# EasyEDA schematic PCB Schematic V1.json
TITLE: Sheet_1; REV: 1.0; Date: 2026-10-07; Sheet: 1/1; Drawn By: campbelljacobs21; Company: Your Company
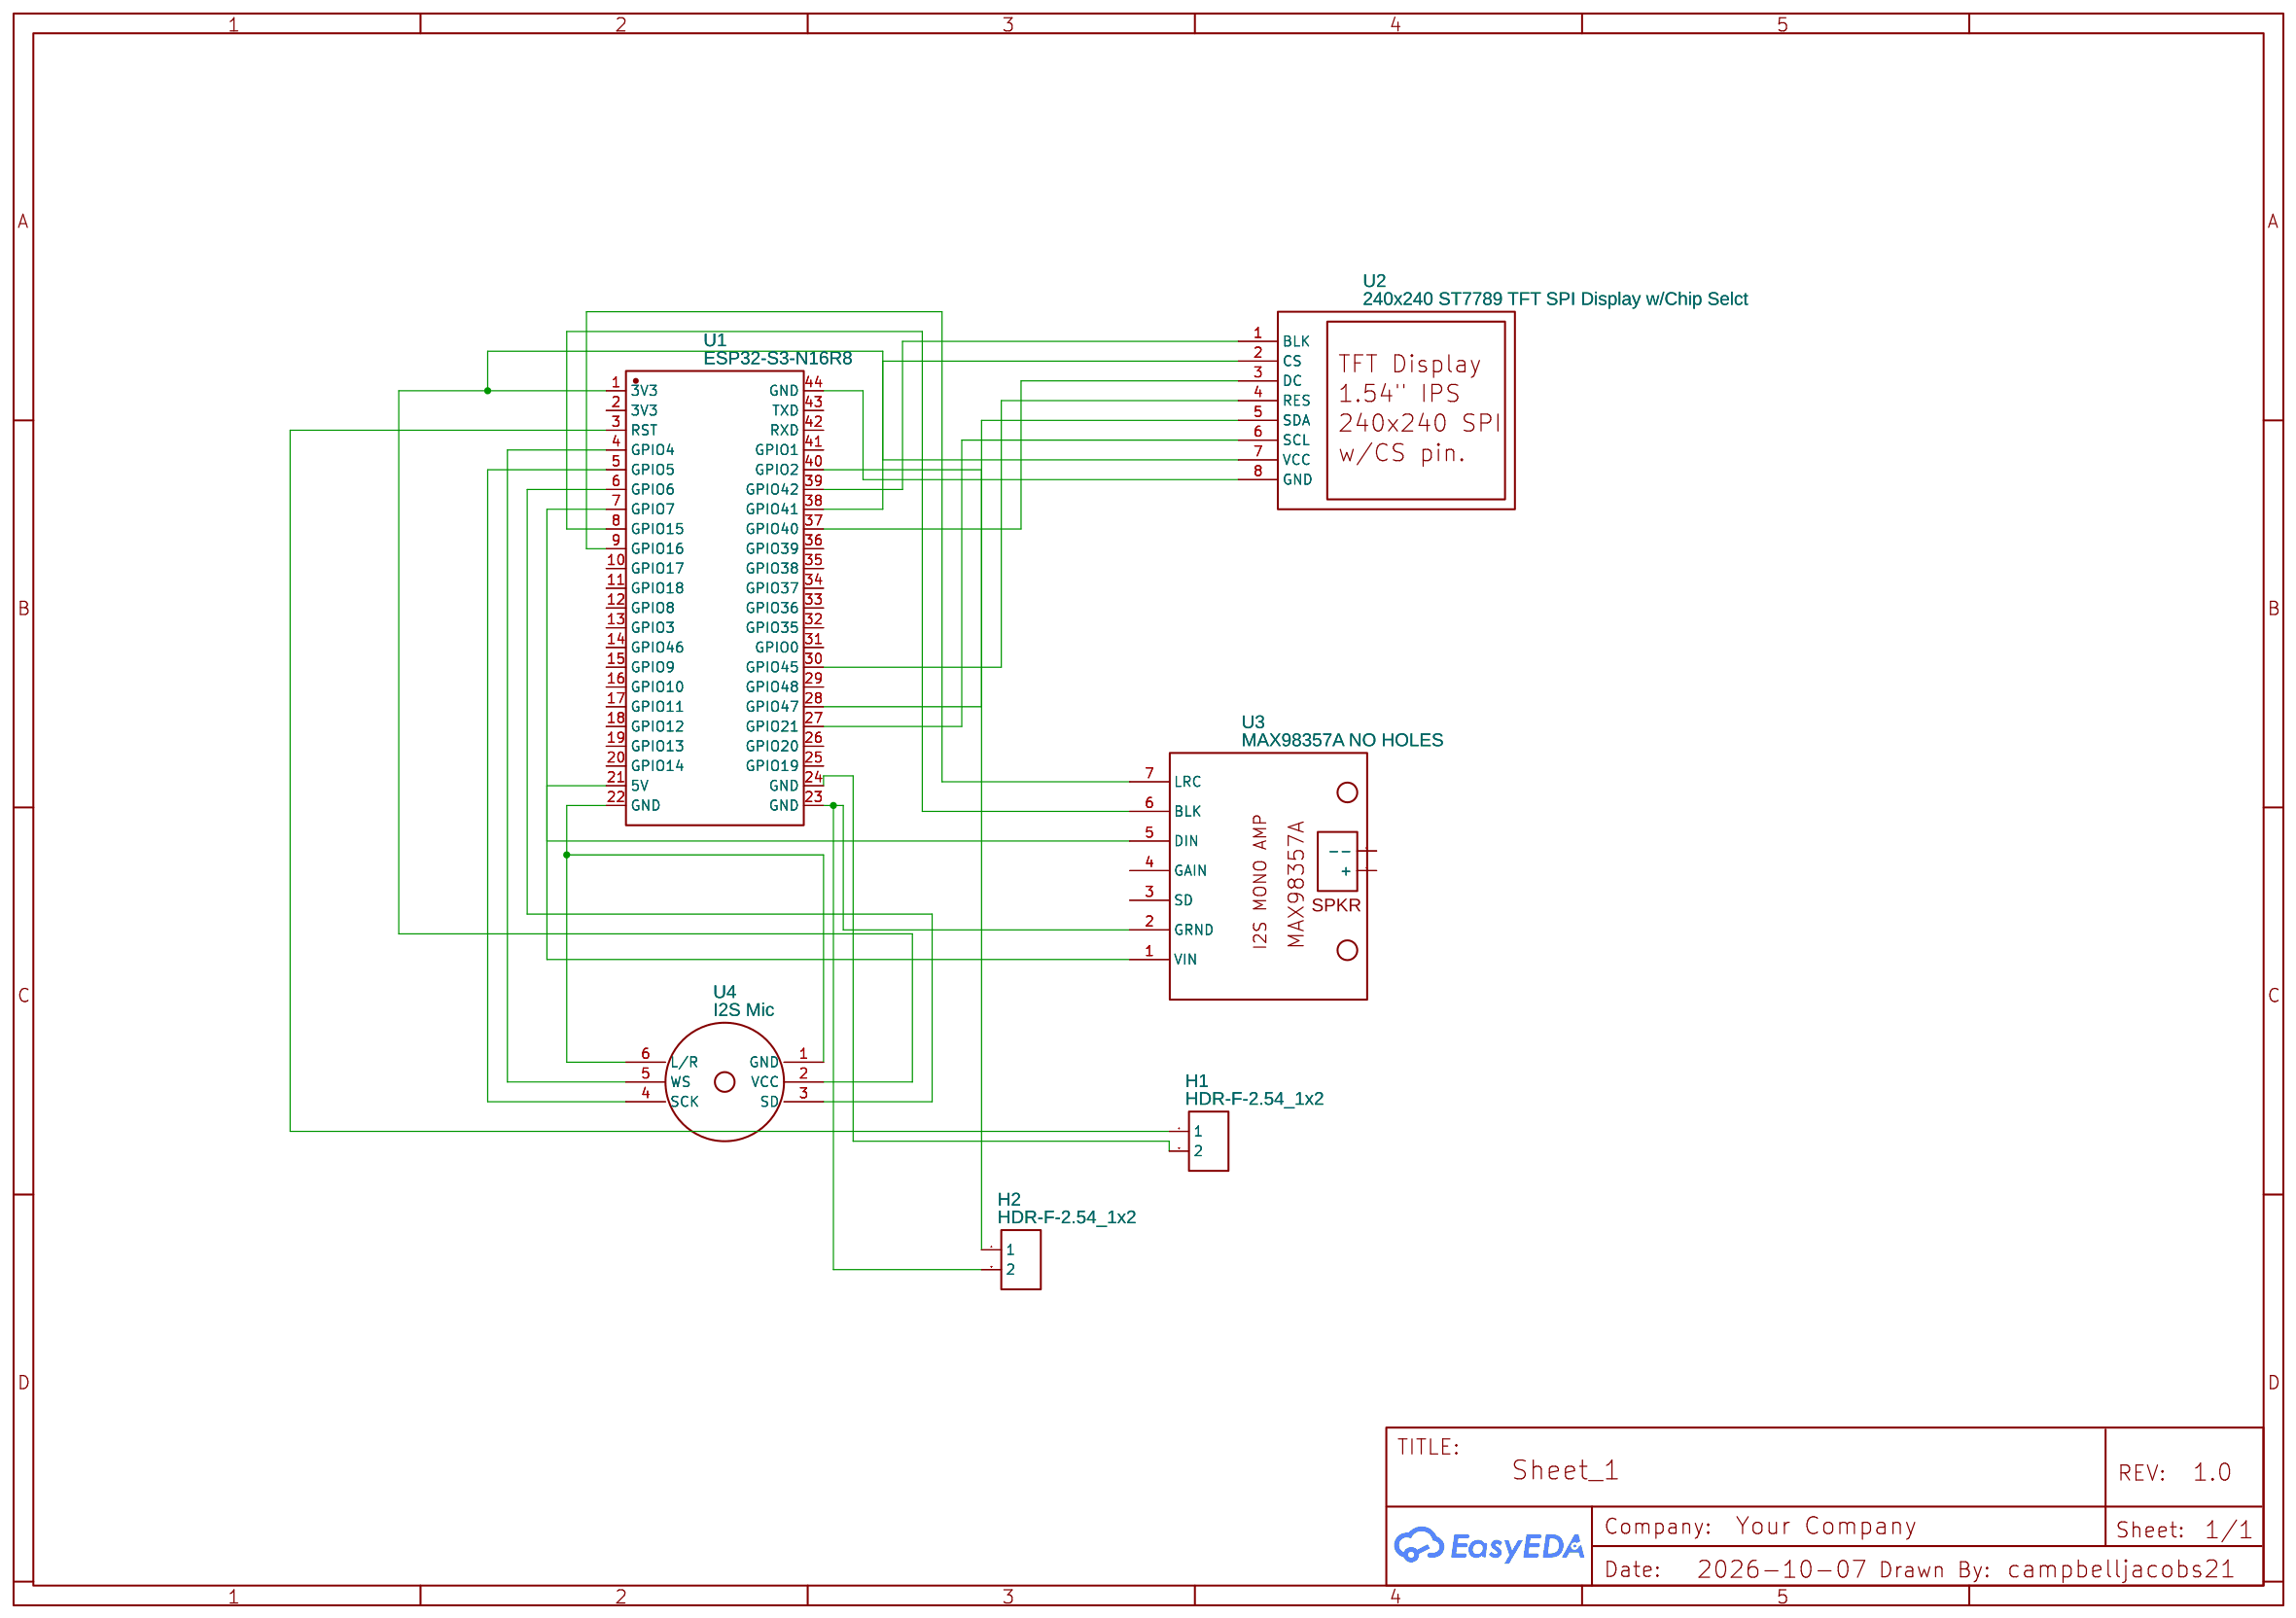
[diagram p0: schematic sheet]

## Parts
H1  HDR-F-2.54_1x2  [HDR-F-2.54_1X2]
H2  HDR-F-2.54_1x2  [HDR-F-2.54_1X2]
U1  ESP32-S3-N16R8  [COMM-TH_ESP32-S3-DEVKITC-N16R8]
U2  240x240 ST7789 TFT SPI Display w/Chip Selct  [240X240 1.54 TFT SPI DISPLAY W_CS]
U3  MAX98357A NO HOLES  [MAX98357A]
U4  I2S Mic  [INMP441-MEMS-I2S-MIC-MODULE]

## Library data of the parts
H1 H2 = HDR-F-2.54_1x2: Supplier Part: C49661; Supplier: LCSC; Contributor: LCEDA_Lib
U1 = ESP32-S3-N16R8: Supplier: LCSC; Supplier Part: C9900309792; Manufacturer: null; Contributor: lcsc
U2 = 240x240 ST7789 TFT SPI Display w/Chip Selct: link: https://www.aliexpress.com/item/1005001511580368.html; Contributor: mixalisnaxos90
U3 = MAX98357A NO HOLES: Contributor: virskiy
U4 = INMP441-MEMS-I2S-MIC-MODULE: Supplier: ebay; link: https://www.ebay.de/itm/174127178542; Contributor: spnevent

## Nets
Net-(H1-1): H1.1 U1.3(RST)
Net-(H1-2): H1.2 U1.24(GND)
Net-(H2-1): H2.1 U1.40(GPIO2)
Net-(H2-2): H2.2 U1.23(GND) U3.2(GRND)
Net-(U1-1): U1.1(3V3) U2.7(VCC) U4.2(VCC)
Net-(U1-4): U1.4(GPIO4) U4.5(WS)
Net-(U1-5): U1.5(GPIO5) U4.4(SCK)
Net-(U1-6): U1.6(GPIO6) U4.3(SD)
Net-(U1-7): U1.7(GPIO7) U3.5(DIN)
Net-(U1-8): U1.8(GPIO15) U3.6(BLK)
Net-(U1-9): U1.9(GPIO16) U3.7(LRC)
Net-(U1-21): U1.21(5V) U3.1(VIN)
Net-(U1-22): U1.22(GND) U4.1(GND) U4.6(L/R)
Net-(U1-27): U1.27(GPIO21) U2.6(SCL)
Net-(U1-28): U1.28(GPIO47) U2.5(SDA)
Net-(U1-30): U1.30(GPIO45) U2.4(RES)
Net-(U1-37): U1.37(GPIO40) U2.3(DC)
Net-(U1-38): U1.38(GPIO41) U2.2(CS)
Net-(U1-39): U1.39(GPIO42) U2.1(BLK)
Net-(U1-44): U1.44(GND) U2.8(GND)

Not connected (* = marked no-connect by the designer): U1 2(3V3) 10(GPIO17) 11(GPIO18) 12(GPIO8) 13(GPIO3) 14(GPIO46) 15(GPIO9) 16(GPIO10) 17(GPIO11) 18(GPIO12) 19(GPIO13) 20(GPIO14) 25(GPIO19) 26(GPIO20) 29(GPIO48) 31(GPIO0) 32(GPIO35) 33(GPIO36) 34(GPIO37) 35(GPIO38) 36(GPIO39) 41(GPIO1) 42(RXD) 43(TXD); U3 3(SD) 4(GAIN)
